# EAGLE design cores_32bit_v1.1 (EAGLE 5.06)
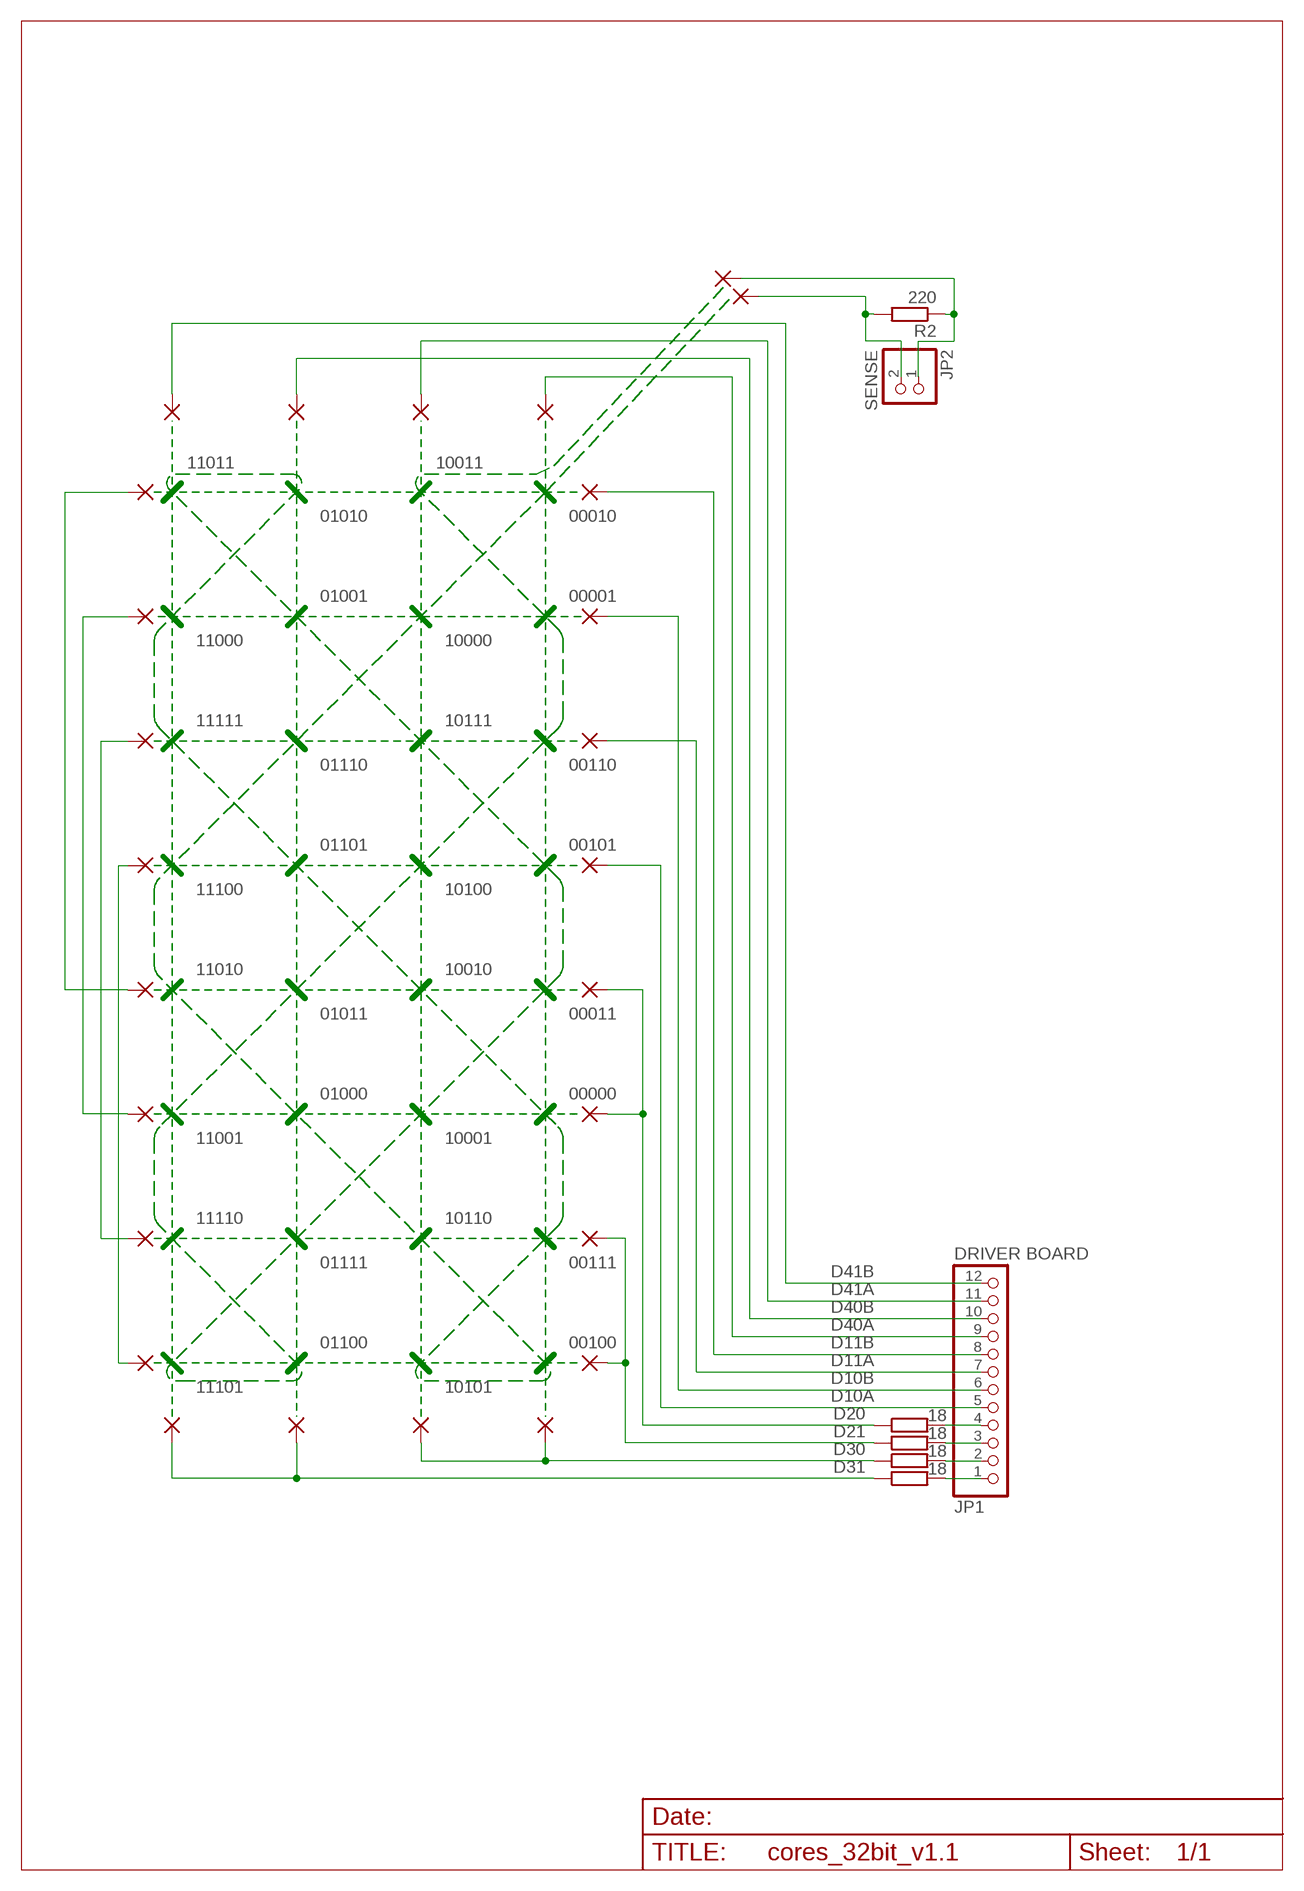
[diagram p0: schematic, sheet 1]

## Parts
JP1  DRIVER BOARD  PINHD-1X12  [1X12]
JP2  SENSE  PINHD-1X2  [1X02]
P10L  WIREPAD2,54/1,1  [2,54/1,1]
P10LT  WIREPAD2,54/1,1  [2,54/1,1]
P10R  WIREPAD2,54/1,1  [2,54/1,1]
P10RT  WIREPAD2,54/1,1  [2,54/1,1]
P11L  WIREPAD2,54/1,1  [2,54/1,1]
P11LT  WIREPAD2,54/1,1  [2,54/1,1]
P11R  WIREPAD2,54/1,1  [2,54/1,1]
P11RT  WIREPAD2,54/1,1  [2,54/1,1]
P20L  WIREPAD2,54/1,1  [2,54/1,1]
P20LT  WIREPAD2,54/1,1  [2,54/1,1]
P20R  WIREPAD2,54/1,1  [2,54/1,1]
P20RT  WIREPAD2,54/1,1  [2,54/1,1]
P21L  WIREPAD2,54/1,1  [2,54/1,1]
P21LT  WIREPAD2,54/1,1  [2,54/1,1]
P21R  WIREPAD2,54/1,1  [2,54/1,1]
P21RT  WIREPAD2,54/1,1  [2,54/1,1]
P30B  WIREPAD2,54/1,1  [2,54/1,1]
P30T  WIREPAD2,54/1,1  [2,54/1,1]
P31B  WIREPAD2,54/1,1  [2,54/1,1]
P31T  WIREPAD2,54/1,1  [2,54/1,1]
P40B  WIREPAD2,54/1,1  [2,54/1,1]
P40T  WIREPAD2,54/1,1  [2,54/1,1]
P41B  WIREPAD2,54/1,1  [2,54/1,1]
P41T  WIREPAD2,54/1,1  [2,54/1,1]
PAD13  WIREPAD2,54/1,1  [2,54/1,1]
PAD15  WIREPAD2,54/1,1  [2,54/1,1]
R1  18  R-EU_R1206  [R1206]
R2  220  R-EU_R1206  [R1206]
R3  18  R-EU_R1206  [R1206]
R4  18  R-EU_R1206  [R1206]
R5  18  R-EU_R1206  [R1206]

## Nets
D10A: JP1.5 P10L.1(P)
D10B: JP1.6 P10R.1(P)
D11A: JP1.7 P11L.1(P)
D11B: JP1.8 P11R.1(P)
D20: P20L.1(P) P20R.1(P) R5.1
D21: P21L.1(P) P21R.1(P) R4.1
D30: P30B.1(P) P30T.1(P) R3.1
D31: P31B.1(P) P31T.1(P) R1.1
D40A: JP1.9 P40B.1(P)
D40B: JP1.10 P40T.1(P)
D41A: JP1.11 P41B.1(P)
D41B: JP1.12 P41T.1(P)
N$1: JP2.1 PAD13.1(P) R2.1
N$2: JP2.2 PAD15.1(P) R2.2
N$3: JP1.1 R1.2
N$4: JP1.2 R3.2
N$6: JP1.3 R4.2
N$7: JP1.4 R5.2
N$17: P10LT.1(P) P21LT.1(P)
N$18: P11LT.1(P) P21RT.1(P)
N$19: P10RT.1(P) P20LT.1(P)
N$20: P11RT.1(P) P20RT.1(P)

## Library data of the parts
JP1 = pinhead:PINHD-1X12: PIN HEADER
JP2 = pinhead:PINHD-1X2: PIN HEADER
P10L P10LT P10R P10RT P11L P11LT P11R P11RT P20L P20LT P20R P20RT P21L P21LT P21R P21RT P30B P30T P31B P31T P40B P40T P41B P41T PAD13 PAD15 = wirepad:WIREPAD: Wire PAD connect wire on PCB
R1-R5 = resistor:R-EU_: RESISTOR, European symbol

## Board
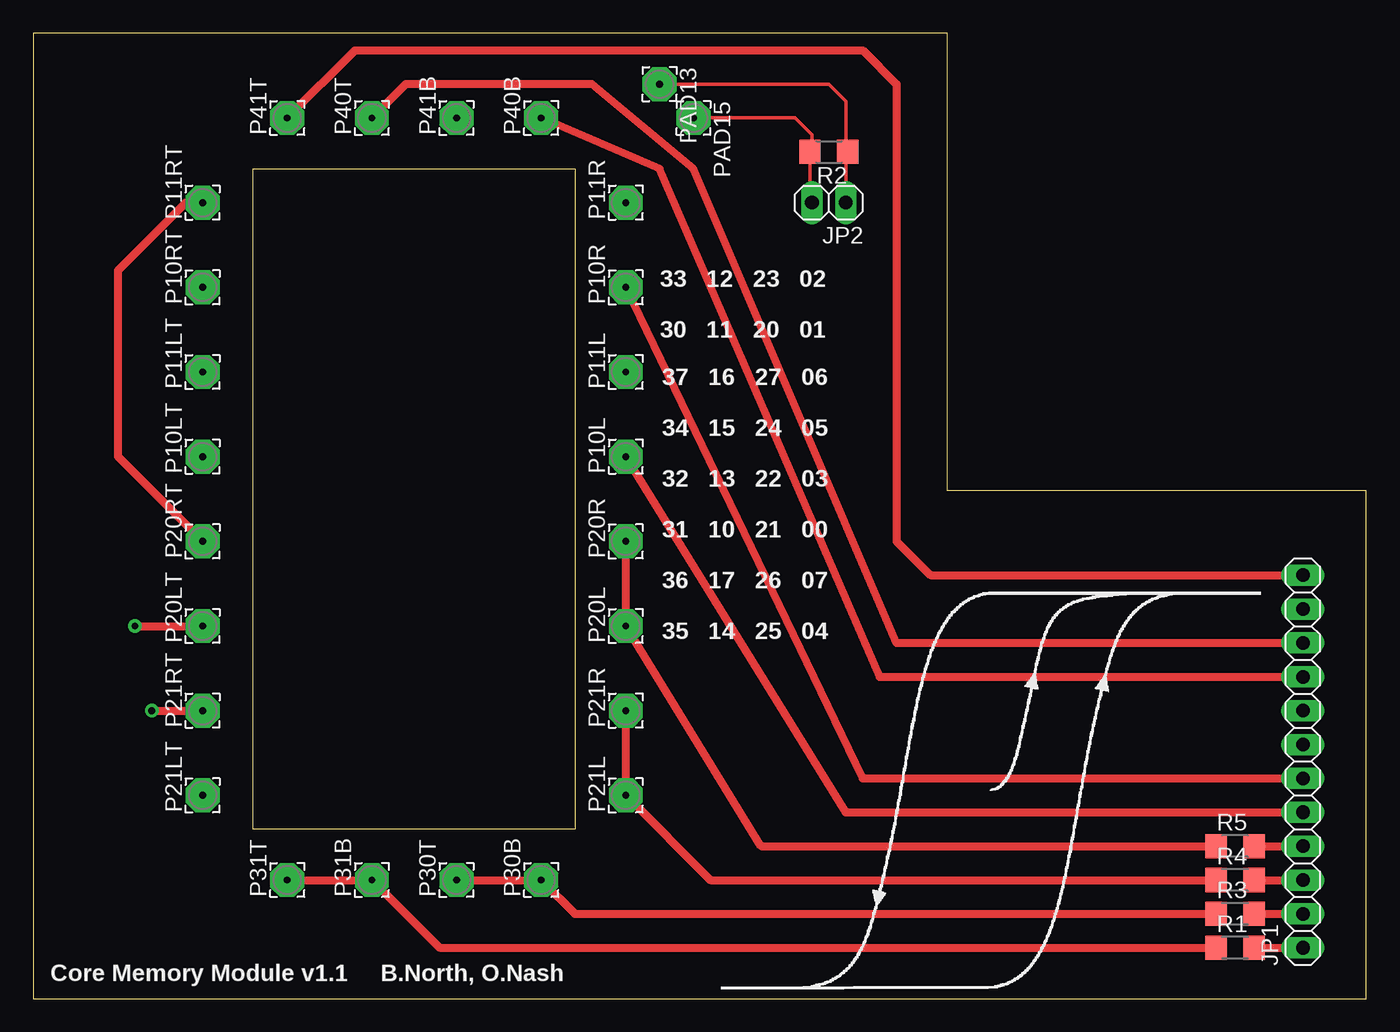
[diagram p1: board, top side]
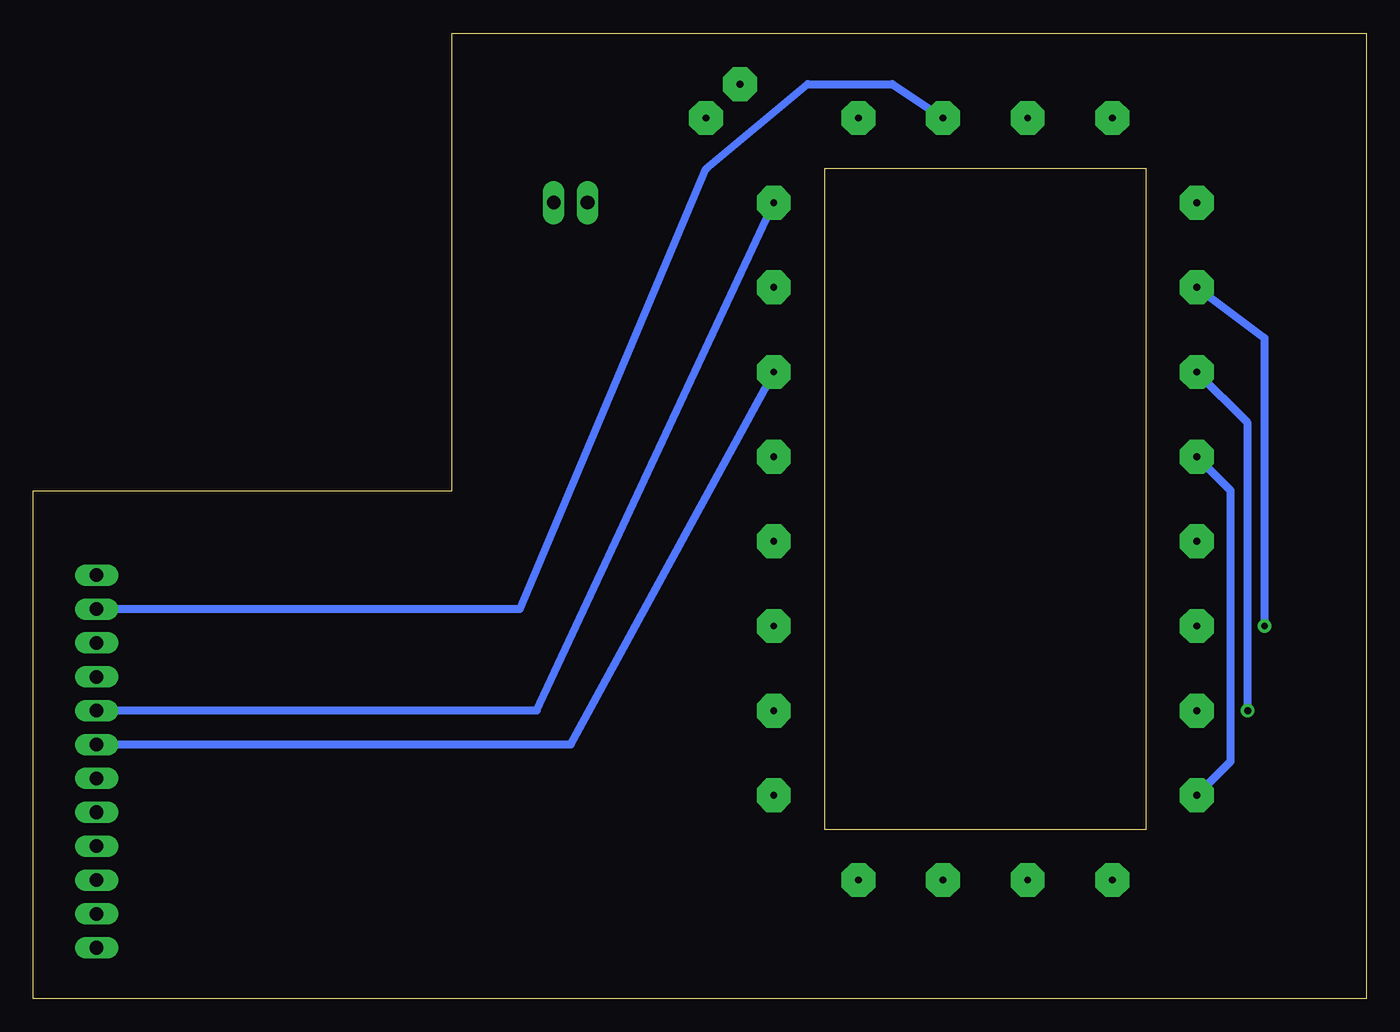
[diagram p2: board, bottom side, seen from below]

Size 100 x 72.39 mm. Coordinates in mm from the lower left corner, seen from the top.
Outline: 0,0 100,0 100,38.09 68.57,38.09 68.58,72.39 0,72.38 0,0
Outline: 16.51,62.23 40.64,62.23 40.64,12.7 16.51,12.7 16.51,62.23
Copper layers (1*16): Top 0.035mm / dielectric 1.5mm / Bottom 0.035mm
Design rules "SparkFun *": minimum track width 8mil, minimum drill 20mil, track to track 8mil, track to pad 8mil, pad to pad 8mil, via to via 8mil, smd to smd 8mil, copper to edge 10mil, drill to drill 8mil, minimum pad ring 12mil, minimum via ring 10mil, stop-mask expansion 4mil, vias tented up to drill 25mil, thermal gap 10mil

### Footprints (pad centres in the part's own frame; a part is rotated, then mirrored left to right if it is on the bottom)
1X12 = drill 1.016 long: 1 -13.97,0; 2 -11.43,0; 3 -8.89,0; 4 -6.35,0; 5 -3.81,0; 6 -1.27,0; 7 1.27,0; 8 3.81,0; 9 6.35,0; 10 8.89,0; 11 11.43,0; 12 13.97,0
1X02 = drill 1.016 long: 1 -1.27,0; 2 1.27,0
2,54/1,1 = drill 0.508 pad 2.54 octagon: 1 0,0
R1206 = smd 1.6 x 1.803: 1 -1.422,0; 2 1.422,0

### Placement (x,y rotation side)
JP1  95.25,17.78 90 top
JP2  59.69,59.69 180 top
P10L  44.45,40.64 90 top
P10LT  12.7,40.64 90 top
P10R  44.45,53.34 90 top
P10RT  12.7,53.34 90 top
P11L  44.45,46.99 90 top
P11LT  12.7,46.99 90 top
P11R  44.45,59.69 90 top
P11RT  12.7,59.69 90 top
P20L  44.45,27.94 90 top
P20LT  12.7,27.94 90 top
P20R  44.45,34.29 90 top
P20RT  12.7,34.29 90 top
P21L  44.45,15.24 90 top
P21LT  12.7,15.24 90 top
P21R  44.45,21.59 90 top
P21RT  12.7,21.59 90 top
P30B  38.1,8.89 90 top
P30T  31.75,8.89 90 top
P31B  25.4,8.89 90 top
P31T  19.05,8.89 90 top
P40B  38.1,66.04 90 top
P40T  25.4,66.04 90 top
P41B  31.75,66.04 90 top
P41T  19.05,66.04 90 top
PAD13  46.99,68.58 270 top
PAD15  49.53,66.04 270 top
R1  90.17,3.81 0 top
R2  59.69,63.5 180 top
R3  90.17,6.35 0 top
R4  90.17,8.89 0 top
R5  90.17,11.43 0 top

### Tracks (layer width: path | path; a pad name or v marks a point on that pad's centre or on a via)
D10A
  Top 0.61: JP1.5 60.96,13.97 P10L.1
D10B
  Top 0.61: JP1.6 62.23,16.51 P10R.1
D11A
  Bottom 0.61: JP1.7 59.69,19.05 P11L.1
D11B
  Bottom 0.61: JP1.8 62.23,21.59 P11R.1
D20
  Top 0.61: P20R.1 P20L.1 54.61,11.43 R5.1
D21
  Top 0.61: P21R.1 P21L.1 50.8,8.89 R4.1
D30
  Top 0.61: P30T.1 P30B.1 40.64,6.35 R3.1
D31
  Top 0.61: P31T.1 P31B.1 30.48,3.81 R1.1
D40A
  Top 0.61: JP1.9 63.5,24.13 46.99,62.23 P40B.1
D40B
  Top 0.61: JP1.10 64.77,26.67 49.53,62.23 41.91,68.58 27.94,68.58 P40T.1
D41A
  Bottom 0.61: JP1.11 63.5,29.21 49.53,62.23 41.91,68.58 35.56,68.58 P41B.1
D41B
  Top 0.61: JP1.12 67.31,31.75 64.77,34.29 64.77,68.58 62.23,71.12 24.13,71.12 P41T.1
N$1
  Top 0.254: PAD13.1 59.69,68.58 60.96,67.31 60.96,63.65 R2.1 60.96,63.35 JP2.1
N$2
  Top 0.254: PAD15.1 57.15,66.04 58.42,64.77 58.42,63.65 R2.2 58.27,59.84 JP2.2
N$3
  Top 0.61: R1.2 JP1.1
N$4
  Top 0.61: R3.2 JP1.2
N$6
  Top 0.61: R4.2 JP1.3
N$7
  Top 0.61: R5.2 JP1.4
N$17
  Bottom 0.61: P10LT.1 10.16,38.1 10.16,17.78 P21LT.1
N$18  (via drill 0.51)
  Top 0.61: v8.89,21.59 P21RT.1
  Bottom 0.61: v8.89,21.59 8.89,43.18 P11LT.1
N$19  (via drill 0.51)
  Top 0.61: v7.62,27.94 P20LT.1
  Bottom 0.61: v7.62,27.94 7.62,49.53 P10RT.1
N$20
  Top 0.61: P11RT.1 11.43,59.69 6.35,54.61 6.35,40.64 P20RT.1

### Text on the board
tPlace: 33 12 23 02 | 30 11 20 01 | 37 16 27 06 | 34 15 24 05 | 32 13 22 03 | 31 10 21 00 | 36 17 26 07 | 35 14 25 04 | Core Memory Module v1.1 B.North, O.Nash